# EAGLE schematic LM393 (EAGLE 9.6.2)
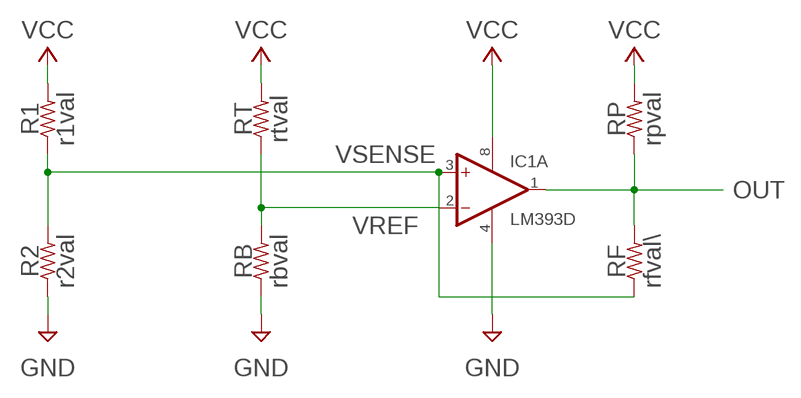
[diagram p0: schematic, sheet 1]

## Parts
IC1  LM393D  [SO08]
R1  r1val  R-US_0204/7  [0204/7]
R2  r2val  R-US_0204/7  [0204/7]
RB  rbval  R-US_0204/7  [0204/7]
RF  rfval\  R-US_0204/7  [0204/7]
RP  rpval  R-US_0204/7  [0204/7]
RT  rtval  R-US_0204/7  [0204/7]

## Nets
GND: IC1.4(P:V-) R2.1 RB.1
OUT: IC1.1(A:OUT) RF.2 RP.1
VCC: IC1.8(P:V+) R1.2 RP.2 RT.2
VREF: IC1.2(A:-IN) RB.2 RT.1
VSENSE: IC1.3(A:+IN) R1.1 R2.2 RF.1
Unconnected: IC1.5(B:+IN) IC1.6(B:-IN) IC1.7(B:OUT)

## Library data of the parts
IC1 = linear:LM393: COMPARATOR
R1 R2 RB RF RP RT = rcl:R-US_: RESISTOR, American symbol; SPICEPREFIX: R